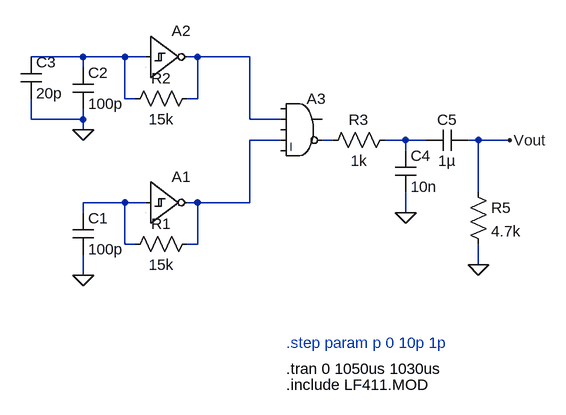
[diagram p0: schematic draft3.asc]
draft3.asc, the LTspice schematic file:
Version 4
SHEET 1 1340 756
WIRE 16 0 -64 0
WIRE 80 0 16 0
WIRE 112 0 80 0
WIRE 192 0 176 0
WIRE 272 0 192 0
WIRE 16 16 16 0
WIRE 80 64 80 0
WIRE 96 64 80 64
WIRE 192 64 192 0
WIRE 192 64 176 64
WIRE -64 96 -64 64
WIRE 16 96 16 80
WIRE 16 96 -64 96
WIRE 272 96 272 0
WIRE 320 96 272 96
WIRE 16 112 16 96
WIRE 320 128 272 128
WIRE 400 128 384 128
WIRE 512 128 480 128
WIRE 544 128 512 128
WIRE 624 128 608 128
WIRE 672 128 624 128
WIRE 512 144 512 128
WIRE 624 208 624 128
WIRE 80 224 16 224
WIRE 112 224 80 224
WIRE 192 224 176 224
WIRE 272 224 272 128
WIRE 272 224 192 224
WIRE 16 240 16 224
WIRE 512 240 512 208
WIRE 80 288 80 224
WIRE 96 288 80 288
WIRE 192 288 192 224
WIRE 192 288 176 288
WIRE 624 320 624 288
WIRE 16 336 16 304
FLAG 16 336 0
FLAG 16 112 0
FLAG 512 240 0
FLAG 624 320 0
FLAG 672 128 Vout
SYMBOL Digital\\schmtinv 112 160 R0
WINDOW 3 -71 111 Invisible 0
SYMATTR Value Vhigh=9, Vt=4.5, Vh=0.3, trise=20n, tfall=20n
SYMATTR InstName A1
SYMBOL res 192 272 R90
WINDOW 0 0 56 VBottom 0
WINDOW 3 32 56 VTop 0
SYMATTR InstName R1
SYMATTR Value 15k
SYMBOL cap 0 240 R0
SYMATTR InstName C1
SYMATTR Value 100p
SYMBOL Digital\\schmtinv 112 -64 R0
WINDOW 3 -71 111 Invisible 0
SYMATTR Value Vhigh=9, Vt=4.5, Vh=0.3, trise=20n, tfall=20n
SYMATTR InstName A2
SYMBOL res 192 48 R90
WINDOW 0 0 56 VBottom 0
WINDOW 3 32 56 VTop 0
SYMATTR InstName R2
SYMATTR Value 15k
SYMBOL cap 0 16 R0
SYMATTR InstName C2
SYMATTR Value 100p
SYMBOL cap -80 0 R0
SYMATTR InstName C3
SYMATTR Value 20p
SYMBOL Digital\\and 352 48 R0
WINDOW 3 16 52 Invisible 0
SYMATTR Value trise=20n, tfall=20n, Vt=4.5, Vhigh=9
SYMATTR InstName A3
SYMBOL res 496 112 R90
WINDOW 0 0 56 VBottom 0
WINDOW 3 32 56 VTop 0
SYMATTR InstName R3
SYMATTR Value 1k
SYMBOL cap 496 144 R0
SYMATTR InstName C4
SYMATTR Value 10n
SYMBOL cap 608 112 R90
WINDOW 0 0 32 VBottom 0
WINDOW 3 32 32 VTop 0
SYMATTR InstName C5
SYMATTR Value 1µ
SYMBOL res 608 192 R0
SYMATTR InstName R5
SYMATTR Value 4.7k
TEXT 328 480 Left 0 !.tran 0 1050us 1030us
TEXT 328 440 Left 0 ;.step param p 0 10p 1p
TEXT 328 504 Left 0 !.include LF411.MOD

The netlist it stands for:
* draft3.asc
A1 N006 0 0 0 0 N003 0 0 SCHMITT Vhigh=9, Vt=4.5, Vh=0.3, trise=20n, tfall=20n
R1 N003 N006 15k
C1 N006 0 100p
A2 N001 0 0 0 0 N002 0 0 SCHMITT Vhigh=9, Vt=4.5, Vh=0.3, trise=20n, tfall=20n
R2 N002 N001 15k
C2 N001 0 100p
C3 N001 0 20p
A3 0 N002 0 N003 0 N004 0 0 AND trise=20n, tfall=20n, Vt=4.5, Vhigh=9
R3 N005 N004 1k
C4 N005 0 10n
C5 Vout N005 1µ
R5 Vout 0 4.7k
.tran 0 1050us 1030us
* .step param p 0 10p 1p
.include LF411.MOD
.backanno
.end